# EasyEDA schematic Sheet_1_2020-06-07_17-54-32.json

## Sheets
1 Sheet_2: TITLE: New Schematic; REV: 1.0; Date: 2017-01-21; Sheet: 1/1; Drawn By: Your Name
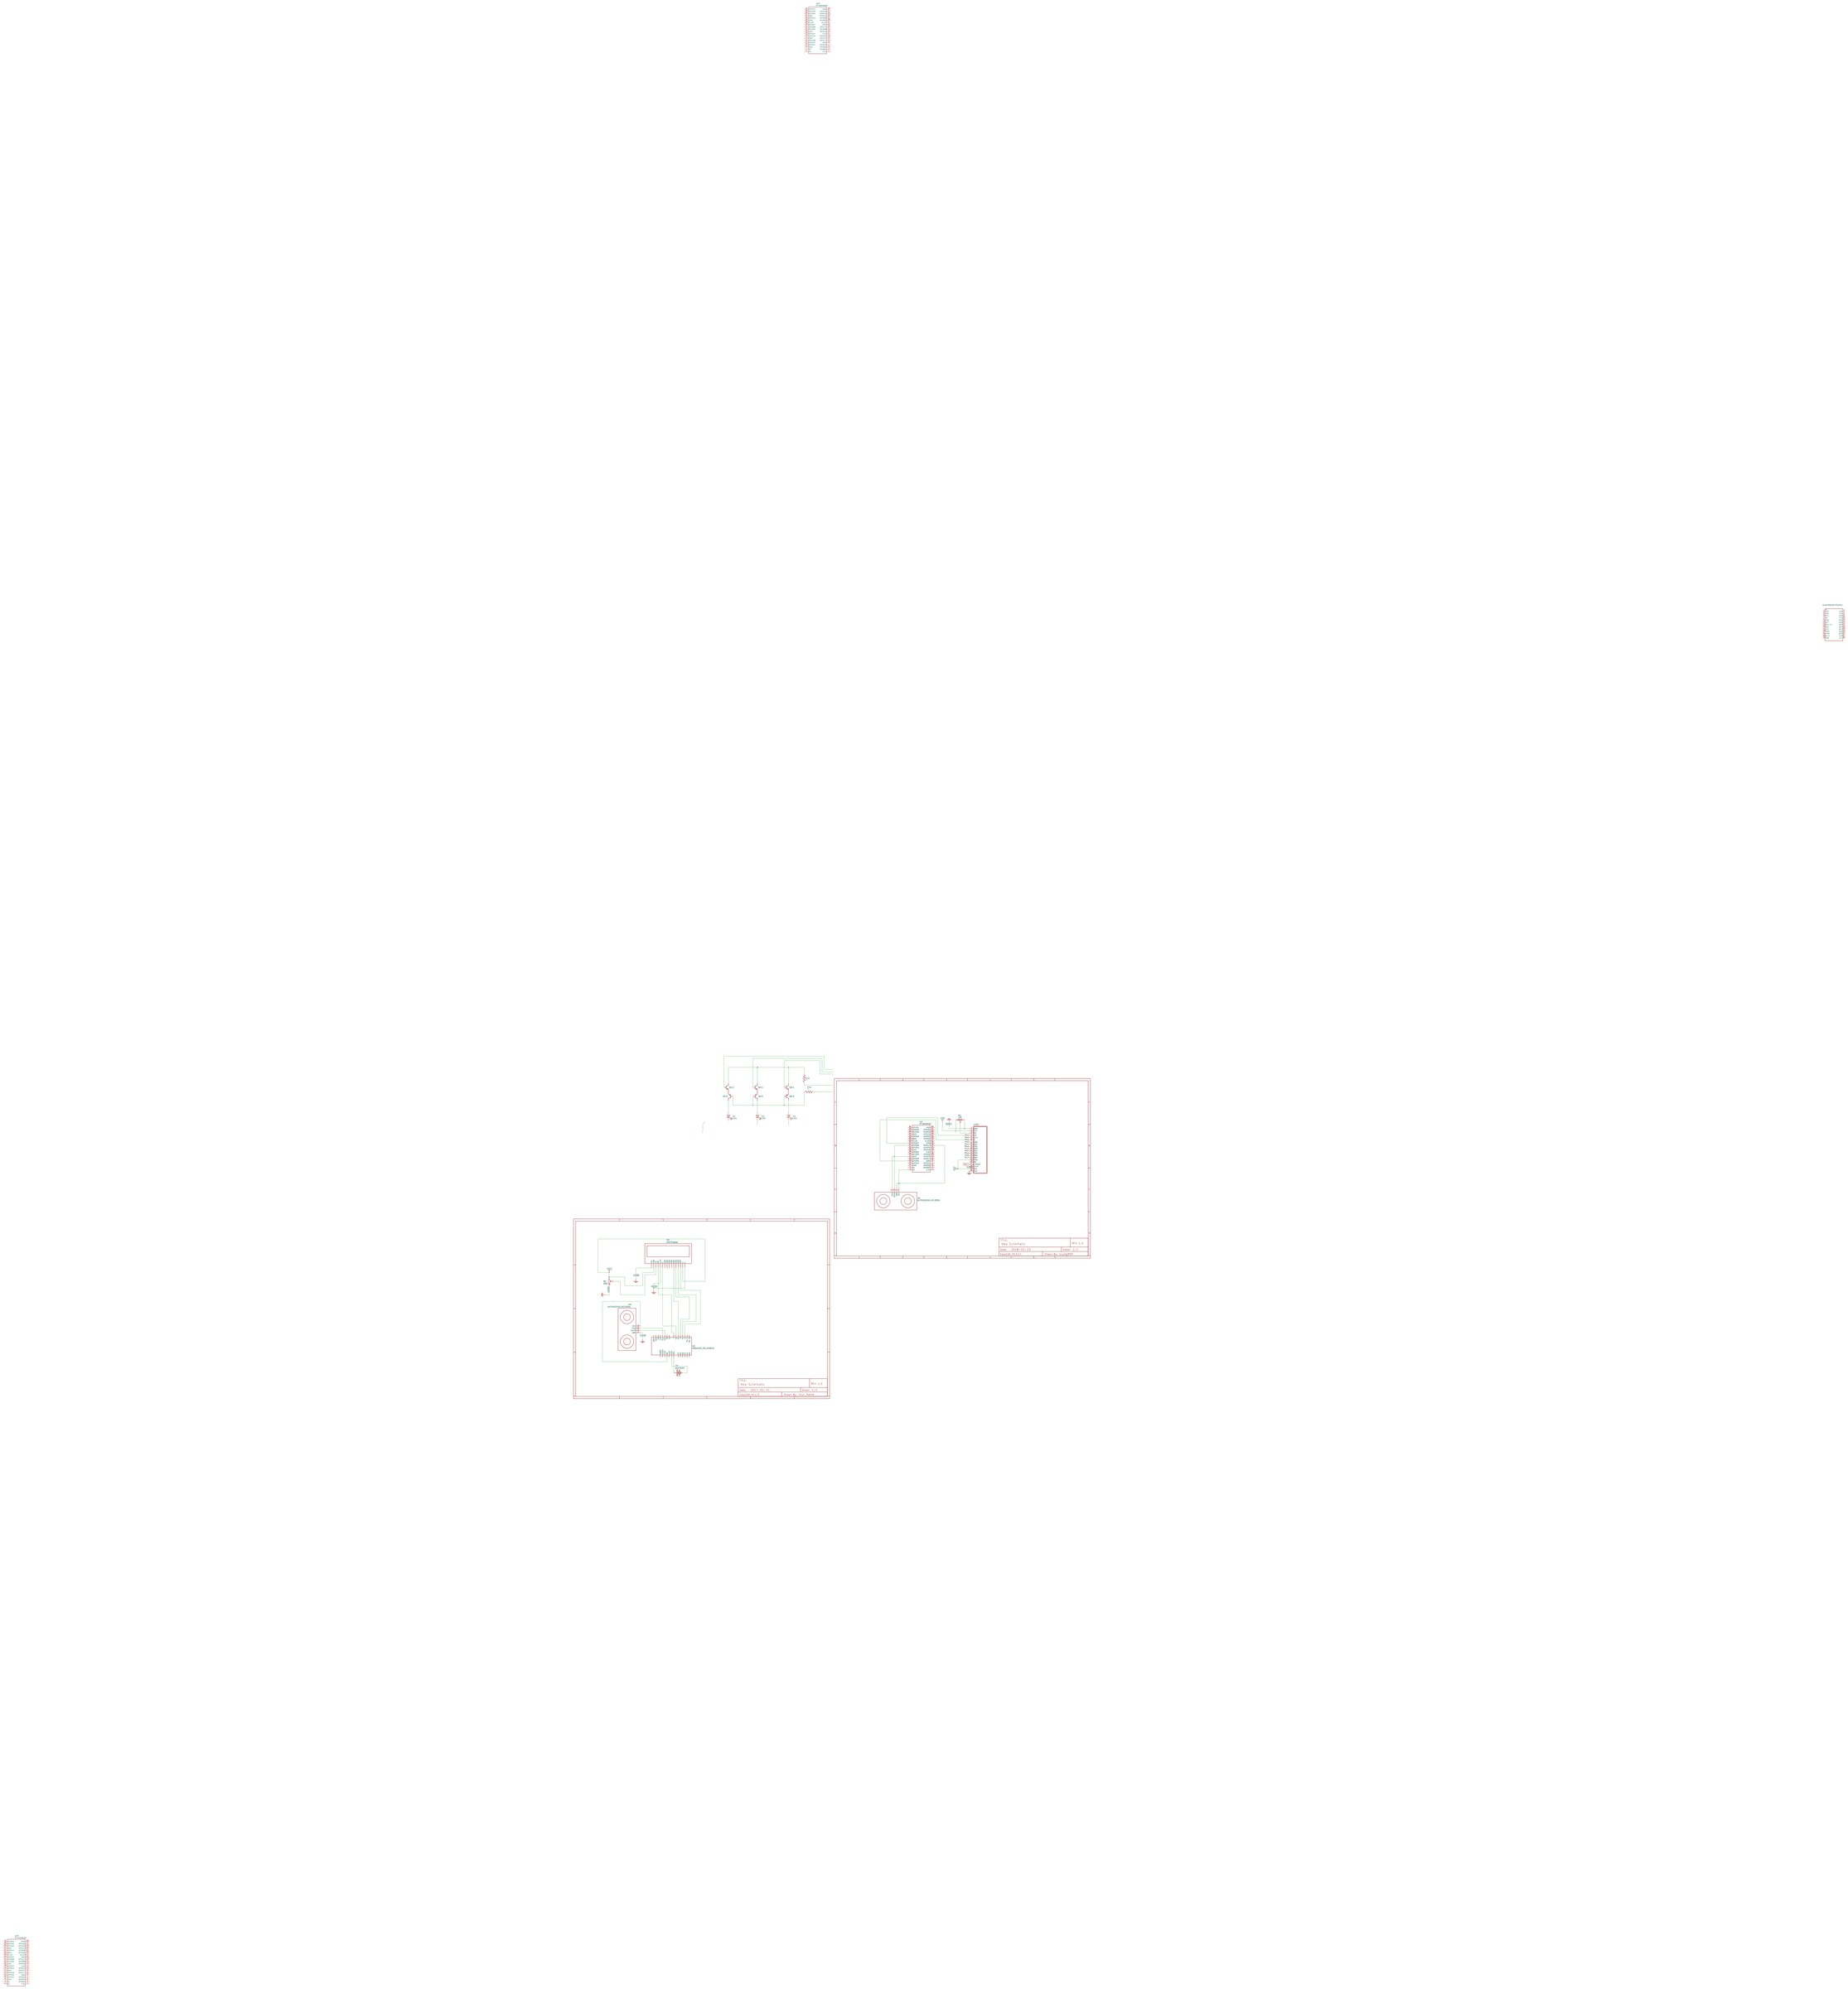
[diagram p0: Sheet_2]
2 Sheet_1: TITLE: Design a PCB; Date: 2020-05-06; Drawn By: Abhishek Kapoor
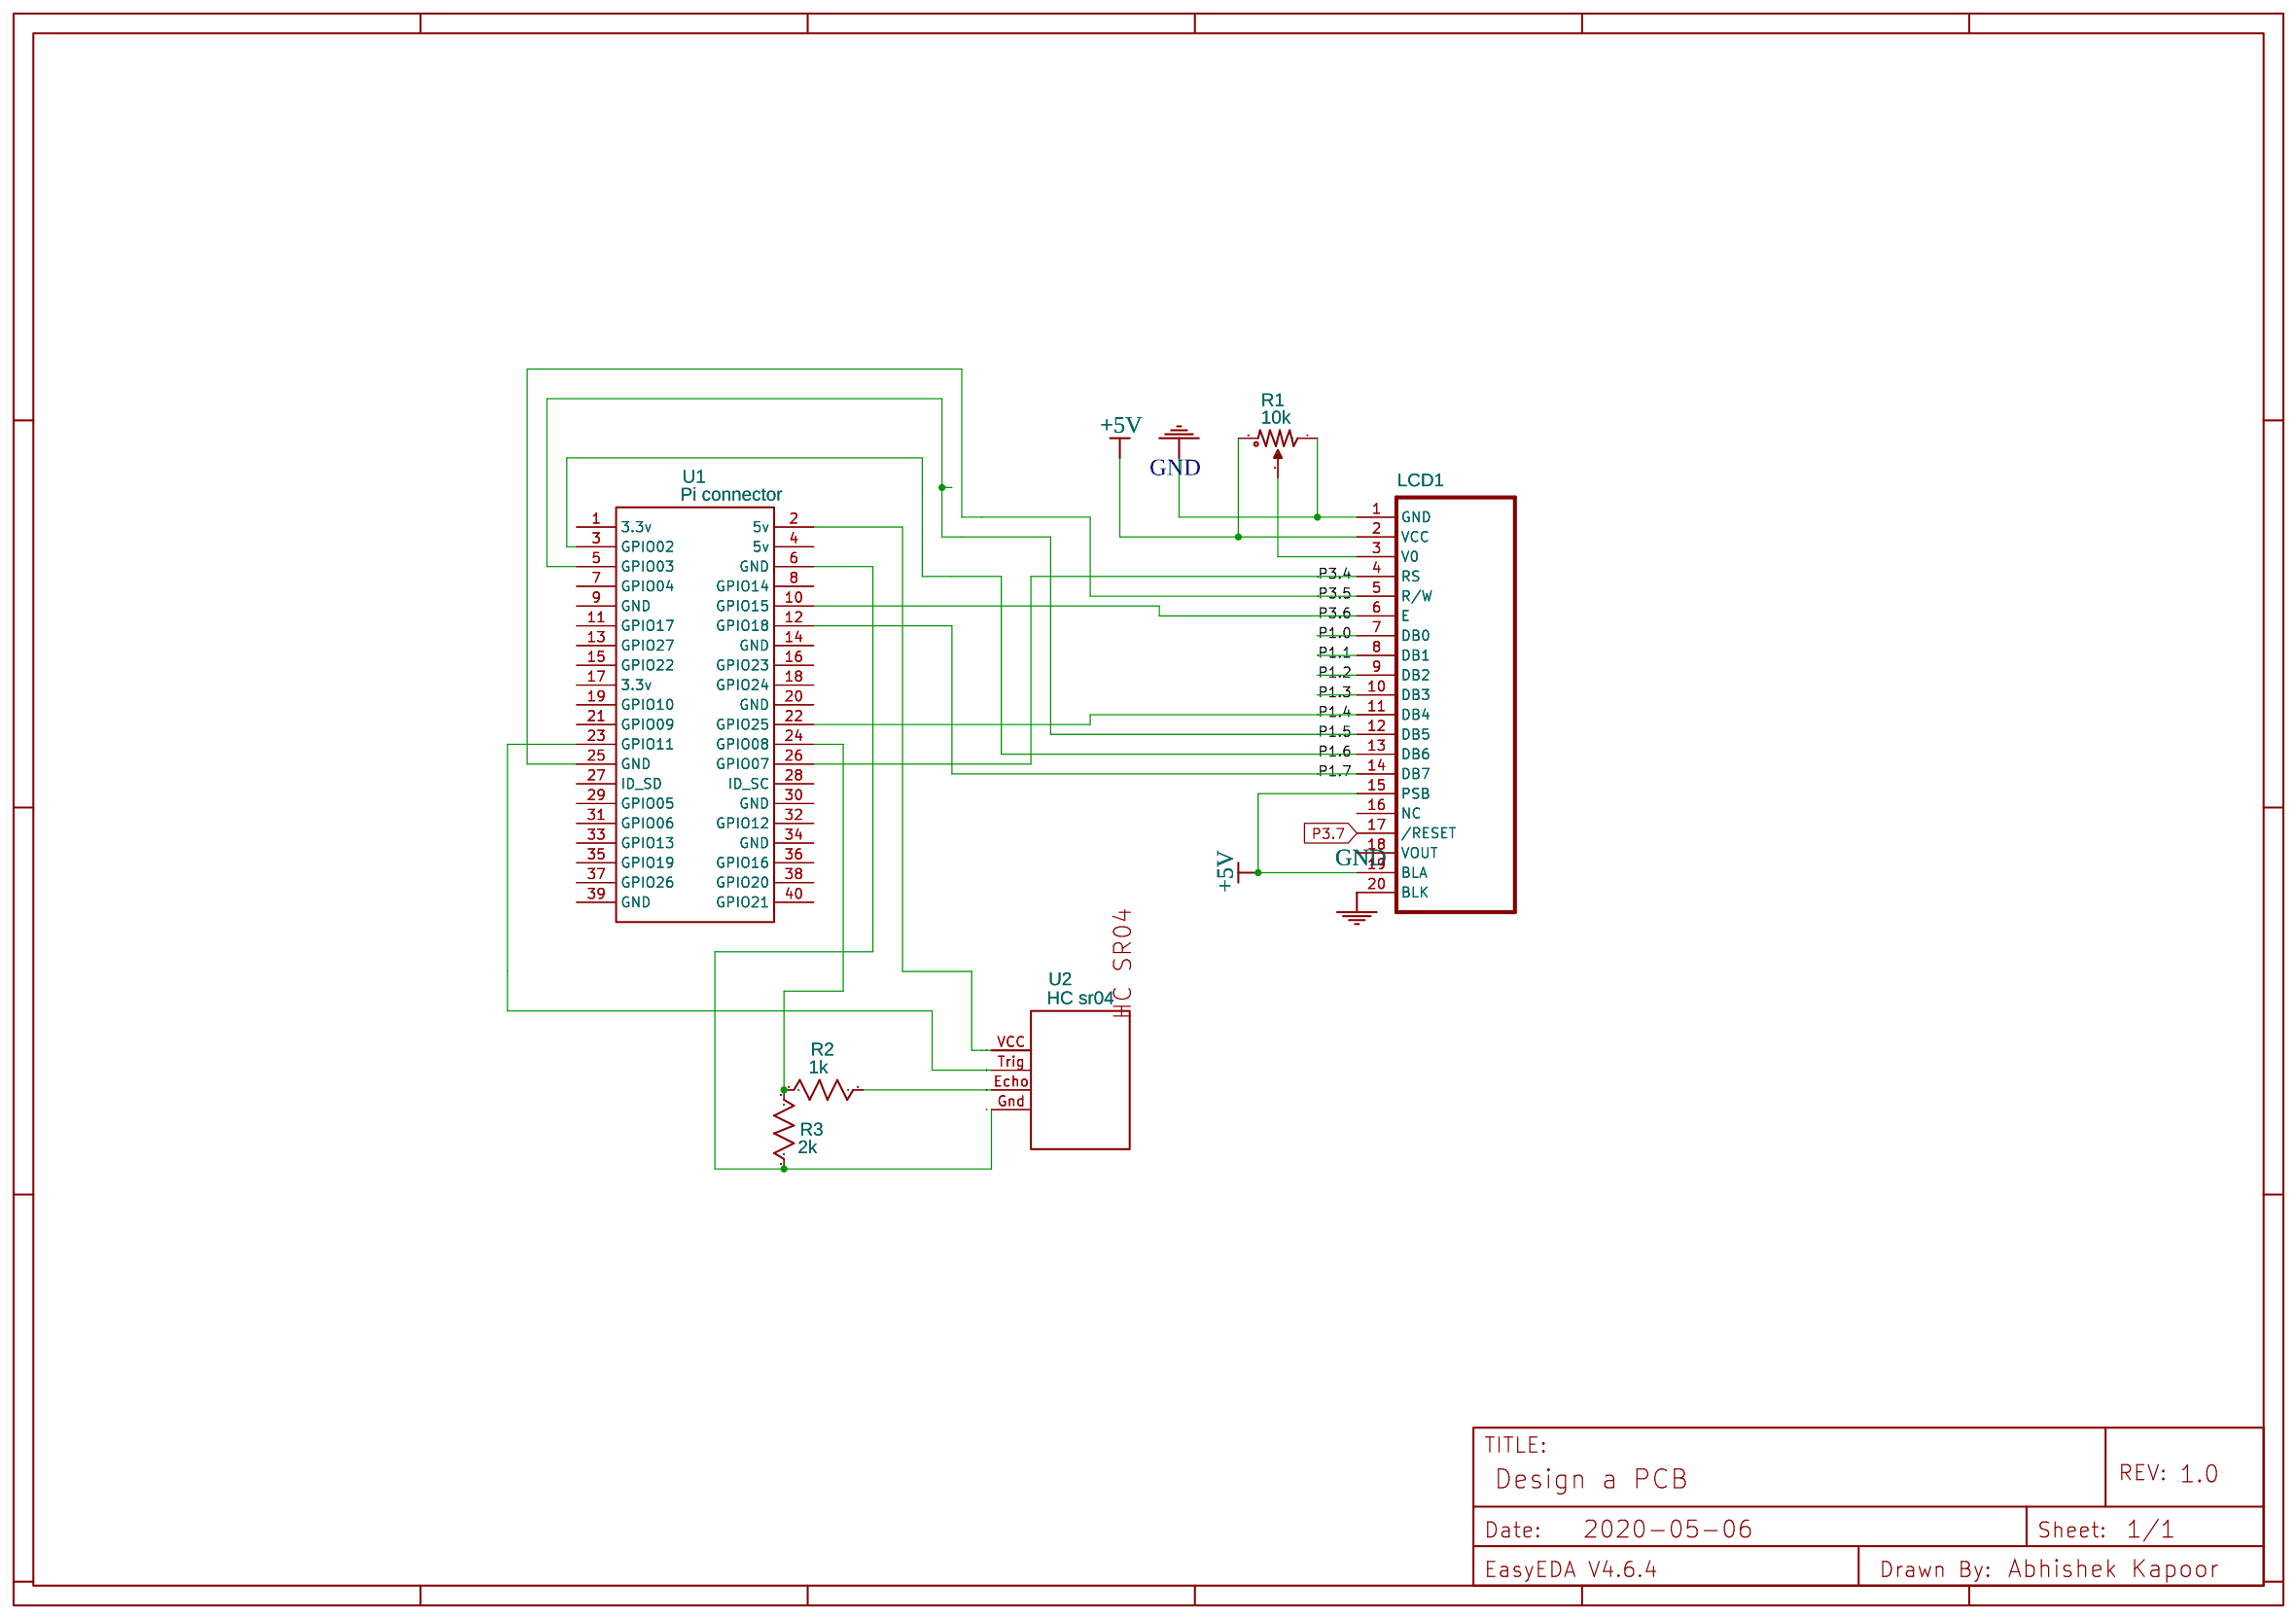
[diagram p1: Sheet_1]

## Parts
sheet Sheet_1
LCD1#2  LCD12864  [H20-2.54]
R1#2  10k  [卧式蓝白可调电阻]
R2#2  1k  [AXIAL-0.3]
R3  2k  [AXIAL-0.3]
U1#2  Pi connector  [PI CONNECTOR]
U2#2  HC sr04
sheet Sheet_2
?V  BATTERY  [BATTERY-AAA]
D1  LED  [LED3MM]
D2  LED  [LED3MM]
D3  LED  [LED3MM]
LCD1  LCD12864  [H20-2.54]
Q1-1  2DC2412R  [SOT23]
Q1-2  NO  [SOT23]
Q2-1  2DC2412R  [SOT23]
Q2-2  NO  [SOT23]
Q3-1  2DC2412R  [SOT23]
Q3-2  NO  [SOT23]
R1  10k  [卧式蓝白可调电阻]
R2  100k  [RES-ADJ_3386P]
R33  ?  [R3]
R34  ?  [R3]
RASPBERRYPIGPIO  Raspberry Pi
U1  Pi connector  [PI CONNECTOR]
U2  ARDUINO_R3_SHIELD  [UNO_R3_SHIELD_NOLABELS]
U3  ULTRASONIC-HC-SR04  [ULTRASONIC-HC-SR04]
U4  LCD Display
U5  ULTRASONIC-HC-SR04  [ULTRASONIC-HC-SR04]
U23  Pi connector  [PI CONNECTOR]
U24  Pi connector  [PI CONNECTOR]

## Library data of the parts
LCD1 LCD1#2 = -: DIP Black Female Header VERT;; catid: 20; Supplier: SeeedStudio; Manufacturer Part: 2.54单排座20pin; sourceId: womkhDn7R; Supplier Part: 320030027
R1 R1#2 R2 = Potentiometer: K(%): 50; Manufacturer Part: ?
R2#2 R3 = Res_AXIAL-0.3(1/8W)_US: Manufacturer Part: ?
U1 U1#2 U23 U24 = -: Contributor: jjvan; sourceId: ylVTRcawS; Manufacturer Part: ?
U2#2 = -: Contributor: 19u38738
?V = -: catid: 20; Contributor: SparkFun; Manufacturer Part: ?
D1-D3 = LED: Manufacturer Part: ?
Q1-1 Q2-1 Q3-1 = NPN: catid: 20; Manufacturer Part: ?
Q1-2 Q2-2 Q3-2 = PNP: Manufacturer Part: ?
R33 R34 = Resistor
RASPBERRYPIGPIO = -: Manufacturer Part: ?
U2 = -: catid: 20; Manufacturer Part: ?
U3 = -: Ultrasonic Ranging Module HC-SR04; catid: 20; sourceId: iECXHFpLv; Manufacturer Part: ?
U4 = -: catid: 20; sourceId: nq0Yk42Zl; Manufacturer Part: ?
U5 = -: Ultrasonic Ranging Module HC-SR04; catid: 20; sourceId: iECXHFpLv; Manufacturer Part: ?; Supplier: RS-Online

## Nets
+5V: LCD1.2(VCC) LCD1.15(PSB) LCD1.19(BLA) LCD1#2.2(VCC) LCD1#2.15(PSB) LCD1#2.19(BLA) R1.3(2) R1#2.3(2)
GND: LCD1.1(GND) LCD1.20(BLK) LCD1#2.1(GND) LCD1#2.20(BLK) R1.1 R1#2.1 R2.3(2) U3.4(GND) U4.1(Vss) U4.5(R/W) U4.16(K)
VCC: R2.1 U4.2(VDD) U4.15(A)
P1.0: LCD1.7(DB0) LCD1#2.7(DB0)
P1.1: LCD1.8(DB1) LCD1#2.8(DB1)
P1.2: LCD1.9(DB2) LCD1#2.9(DB2)
P1.3: LCD1.10(DB3) LCD1#2.10(DB3)
P1.4: LCD1.11(DB4) LCD1#2.11(DB4) U1#2.22(GPIO25)
P1.5: LCD1.12(DB5) LCD1#2.12(DB5) U1#2.5(GPIO03)
P1.6: LCD1.13(DB6) LCD1#2.13(DB6) U1#2.3(GPIO02)
P1.7: LCD1.14(DB7) LCD1#2.14(DB7) U1#2.12(GPIO18)
P3.4: LCD1.4(RS) LCD1#2.4(RS) U1.26(GPIO07) U1#2.26(GPIO07)
P3.5: LCD1.5(R/W) LCD1#2.5(R/W) U1#2.25(GND)
P3.6: LCD1.6(E) LCD1#2.6(E) U1.10(GPIO15) U1#2.10(GPIO15)
P3.7: LCD1.17(/RESET) LCD1#2.17(/RESET)
Net-(?V-GND@1): ?V.GND@1(-) U2.A4(GND)
Net-(?V-PWR@1): ?V.PWR@1(+) U2.A5(VIN)
Net-(D1-A): D1.A Q1-2.3(C)
Net-(D2-A): D2.A Q2-2.3(C)
Net-(D3-A): D3.A Q3-2.3(C)
Net-(LCD1#2-3): LCD1#2.3(V0) R1#2.2(3)
Net-(LCD1-3): LCD1.3(V0) R1.2(3)
Net-(Q1-1-2): Q1-1.2(E) Q1-2.2(E)
Net-(Q1-1-3): Q1-1.3(C) Q2-1.3(C) Q3-1.3(C) R33.2
Net-(Q1-2-1): Q1-2.1(B) Q2-2.1(B) Q3-2.1(B) R34.1
Net-(Q2-1-2): Q2-1.2(E) Q2-2.2(E)
Net-(Q3-1-2): Q3-1.2(E) Q3-2.2(E)
Net-(R2#2-1): R2#2.1 R3.1 U1#2.24(GPIO08)
Net-(R2-2): R2.2(3) U4.3(V0)
Net-(R3-2): R3.2 U1#2.6(GND)
Net-(U1-2): U1.2(5v) U5.1(VCC)
Net-(U1-14): U1.14(GND) U5.4(GND)
Net-(U1-23): U1.23(GPIO11) U5.2(TRIG)
Net-(U1-24): U1.24(GPIO08) U5.3(ECHO)
Net-(U2-A2): U2.A2(5V) U3.1(VCC)
Net-(U2-D8): U2.D8(7) U4.4(RS)
Net-(U2-D11): U2.D11(4) U4.12(DB5)
Net-(U2-D13): U2.D13(*11) U3.2(TRIG) U3.3(ECHO) U4.6(E) U4.11(DB4) U4.13(DB6) U4.14(DB7)

Not connected (* = marked no-connect by the designer): D1 K; D2 K; D3 K; LCD1 16(NC) 18(VOUT); LCD1#2 16(NC) 18(VOUT); Q1-1 1(B); Q2-1 1(B); Q3-1 1(B); R2#2 2; R33 1; R34 2; RASPBERRYPIGPIO 1(3v3) 2(5v0) 3(SDA) 4(5v0) 5(GND) 6(GND) 7(#4) 8(TXD) 10(RXD) 11(#17) 12(#18) 13(#21/27) 14(GND) 15(#22) 16(#23) 17(3v3) 18(#24) 19(MOSI) 20(GND) 21(MISO) 22(#25) 23(SCLK) 24(CE0) 25(GND) 26(CE1); U1 1(3.3v) 3(GPIO02) 4(5v) 5(GPIO03) 6(GND) 7(GPIO04) 8(GPIO14) 9(GND) 11(GPIO17) 12(GPIO18) 13(GPIO27) 15(GPIO22) 16(GPIO23) 17(3.3v) 18(GPIO24) 19(GPIO10) 20(GND) 21(GPIO09) 22(GPIO25) 25(GND) 27(ID_SD) 28(ID_SC) 29(GPIO05) 30(GND) 31(GPIO06) 32(GPIO12) 33(GPIO13) 34(GND) 35(GPIO19) 36(GPIO16) 37(GPIO26) 38(GPIO20) 39(GND) 40(GPIO21); U1#2 1(3.3v) 2(5v) 4(5v) 7(GPIO04) 8(GPIO14) 9(GND) 11(GPIO17) 13(GPIO27) 14(GND) 15(GPIO22) 16(GPIO23) 17(3.3v) 18(GPIO24) 19(GPIO10) 20(GND) 21(GPIO09) 23(GPIO11) 27(ID_SD) 28(ID_SC) 29(GPIO05) 30(GND) 31(GPIO06) 32(GPIO12) 33(GPIO13) 34(GND) 35(GPIO19) 36(GPIO16) 37(GPIO26) 38(GPIO20) 39(GND) 40(GPIO21); U2 3.3V(A4) 5V(A3) A0(IOREF) A1(3.3V) A3(GND) AREF(A5) D2(GND) D6(8) IOREF(A0) RES(A1) SCL(RX-0) SDA(TX-1) TX(AREF) VIN(A2); U2#2 Echo(3) Gnd(4) Trig(2) VCC(1); U4 7(DB0) 8(DB1) 9(DB2) 10(DB3); U23 1(3.3v) 2(5v) 3(GPIO02) 4(5v) 5(GPIO03) 6(GND) 7(GPIO04) 8(GPIO14) 9(GND) 10(GPIO15) 11(GPIO17) 12(GPIO18) 13(GPIO27) 14(GND) 15(GPIO22) 16(GPIO23) 17(3.3v) 18(GPIO24) 19(GPIO10) 20(GND) 21(GPIO09) 22(GPIO25) 23(GPIO11) 24(GPIO08) 25(GND) 26(GPIO07) 27(ID_SD) 28(ID_SC) 29(GPIO05) 30(GND) 31(GPIO06) 32(GPIO12) 33(GPIO13) 34(GND) 35(GPIO19) 36(GPIO16) 37(GPIO26) 38(GPIO20) 39(GND) 40(GPIO21); U24 1(3.3v) 2(5v) 3(GPIO02) 4(5v) 5(GPIO03) 6(GND) 7(GPIO04) 8(GPIO14) 9(GND) 10(GPIO15) 11(GPIO17) 12(GPIO18) 13(GPIO27) 14(GND) 15(GPIO22) 16(GPIO23) 17(3.3v) 18(GPIO24) 19(GPIO10) 20(GND) 21(GPIO09) 22(GPIO25) 23(GPIO11) 24(GPIO08) 25(GND) 26(GPIO07) 27(ID_SD) 28(ID_SC) 29(GPIO05) 30(GND) 31(GPIO06) 32(GPIO12) 33(GPIO13) 34(GND) 35(GPIO19) 36(GPIO16) 37(GPIO26) 38(GPIO20) 39(GND) 40(GPIO21)
